# EAGLE design ps3-usb-hid-v10 (EAGLE 5.04)
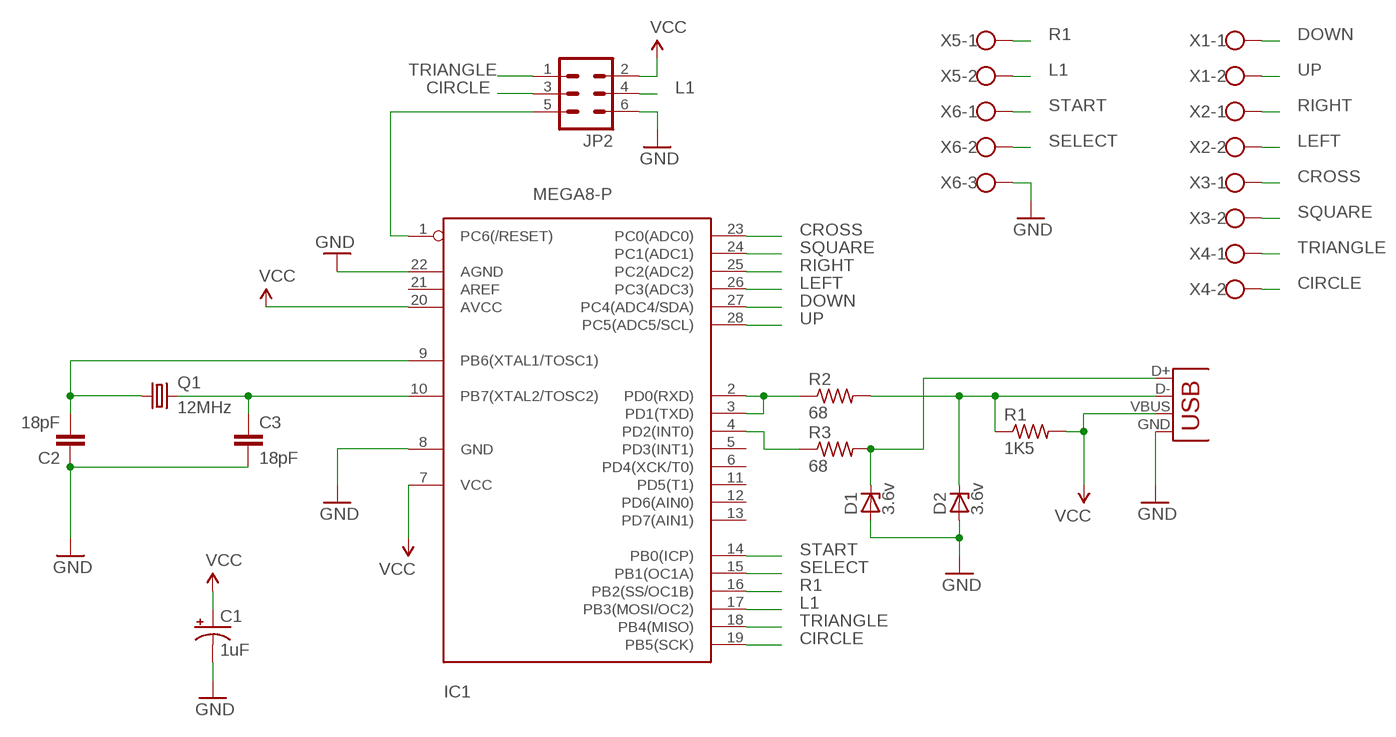
[diagram p0: schematic, sheet 1]

## Parts
C1  1uF  CAP_POLPTH2  [CPOL-RADIAL-10UF-25V]
C2  18pF  CAPPTH  [CAP-PTH-SMALL]
C3  18pF  CAPPTH  [CAP-PTH-SMALL]
D1  3.6v  ZENER-DIODEDO35Z10  [DO35Z10]
D2  3.6v  ZENER-DIODEDO35Z10  [DO35Z10]
IC1  MEGA8-P  [DIL28-3]
JP1  USBPTH  [USB-B-PTH]
JP2  MA03-2  [MA03-2]
Q1  12MHz  CRYSTALHC49S  [HC49/S]
R1  1K5  R-US_0207/10  [0207/10]
R2  68  R-US_0207/10  [0207/10]
R3  68  R-US_0207/10  [0207/10]
X1  W237-102  [W237-102]
X2  W237-102  [W237-102]
X3  W237-102  [W237-102]
X4  W237-102  [W237-102]
X5  W237-102  [W237-102]
X6  W237-103  [W237-103]

## Nets
CIRCLE: IC1.19(PB5(SCK)) JP2.3 X4.2
CROSS: IC1.23(PC0(ADC0)) X3.1
DOWN: IC1.27(PC4(ADC4/SDA)) X1.1
GND: C1.2(-) C2.1 C3.2 D1.A D2.A IC1.8(GND) IC1.22(AGND) JP1.GND JP2.6 X6.3
L1: IC1.17(PB3(MOSI/OC2)) JP2.4 X5.2
LEFT: IC1.26(PC3(ADC3)) X2.2
N$1: C2.2 IC1.9(PB6(XTAL1/TOSC1)) Q1.1
N$2: C3.1 IC1.10(PB7(XTAL2/TOSC2)) Q1.2
N$3: IC1.2(PD0(RXD)) IC1.3(PD1(TXD)) R2.1
N$4: IC1.1(PC6(/RESET)) JP2.5
N$5: D2.C JP1.D- R1.1 R2.2
N$6: IC1.4(PD2(INT0)) R3.1
N$7: D1.C JP1.D+ R3.2
R1: IC1.16(PB2(SS/OC1B)) X5.1
RIGHT: IC1.25(PC2(ADC2)) X2.1
SELECT: IC1.15(PB1(OC1A)) X6.2
SQUARE: IC1.24(PC1(ADC1)) X3.2
START: IC1.14(PB0(ICP)) X6.1
TRIANGLE: IC1.18(PB4(MISO)) JP2.1 X4.1
UP: IC1.28(PC5(ADC5/SCL)) X1.2
VCC: C1.1(+) IC1.7(VCC) IC1.20(AVCC) JP1.VBUS JP2.2 R1.2
Unconnected: IC1.5(PD3(INT1)) IC1.6(PD4(XCK/T0)) IC1.11(PD5(T1)) IC1.12(PD6(AIN0)) IC1.13(PD7(AIN1)) IC1.21(AREF)

## Library data of the parts
C1 = SparkFun:CAP_POL: Capacitor Polarized These are standard SMD and PTH capacitors. Normally 10uF, 47uF, and 100uF in electrolytic and tantalum varieties. Always verify the external diameter of the through hole cap, it varies with capacity, voltage, and manufacturer. The EIA devices should be standard.
C2 C3 = SparkFun:CAP: Capacitor Standard 0603 ceramic capacitor, and 0.1" leaded capacitor.
D1 D2 = diode:ZENER-DIODE: Z-Diode
IC1 = atmel:MEGA8-P: MICROCONTROLLER 8 Kbytes FLASH, 1 kbytes SRAM, 512 bytes EEPROM, USART, 4-channel 10 bit ADC, 2-channel 8 bit ADC Pin compatible with Atmega48, ATMega88, ATMega168 Source: avr.lbr
JP1 = SparkFun:USB: USB Connectors USB-B-PTH is fully proven SKU : PRT-00139 USB-miniB is fully proven SKU : PRT-00587 USB-A-PCB is untested. USB-A-H is throughly reviewed, but untested. Spark Fun Electronics SKU : PRT-00437 USB-B-SMT is throughly reviewed, but untested. Needs silkscreen touching up. USB-A-S has not been used/tested USB-MB-H has not been used/tested
JP2 = con-lstb:MA03-2: PIN HEADER
Q1 = crystal:CRYSTAL: CRYSTAL
R1-R3 = resistor:R-US_: RESISTOR, American symbol
X1-X5 = con-wago-500:W237-102: WAGO SCREW CLAMP
X6 = con-wago-500:W237-103: WAGO SCREW CLAMP

## Board
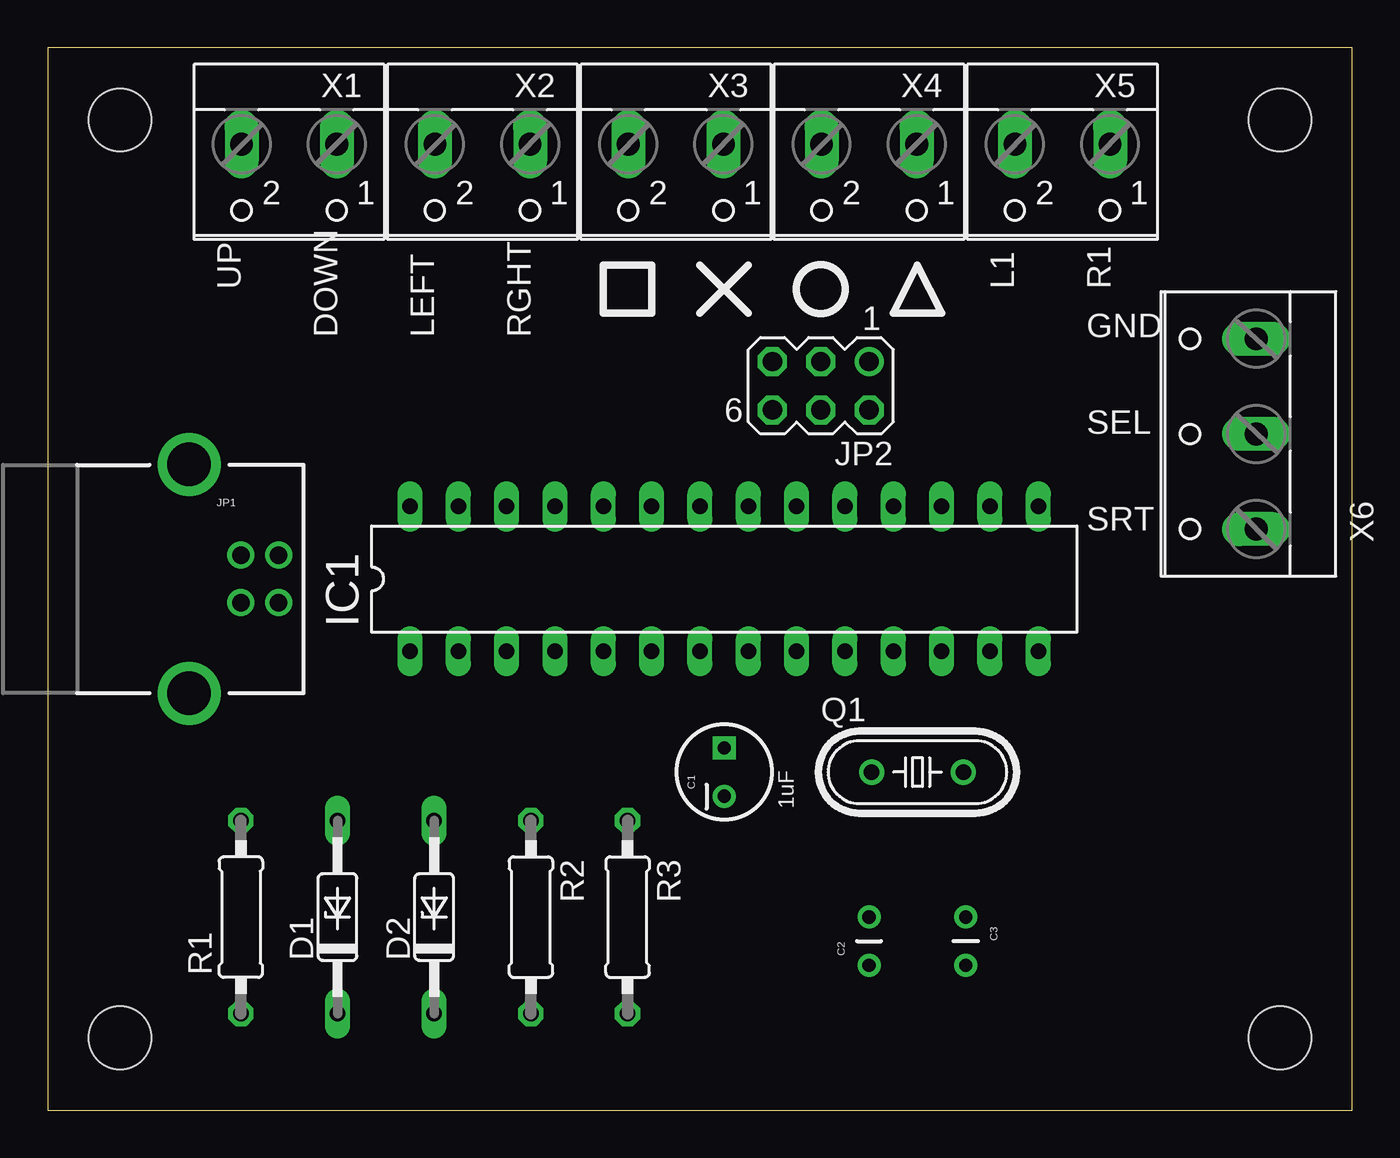
[diagram p1: board, top side]
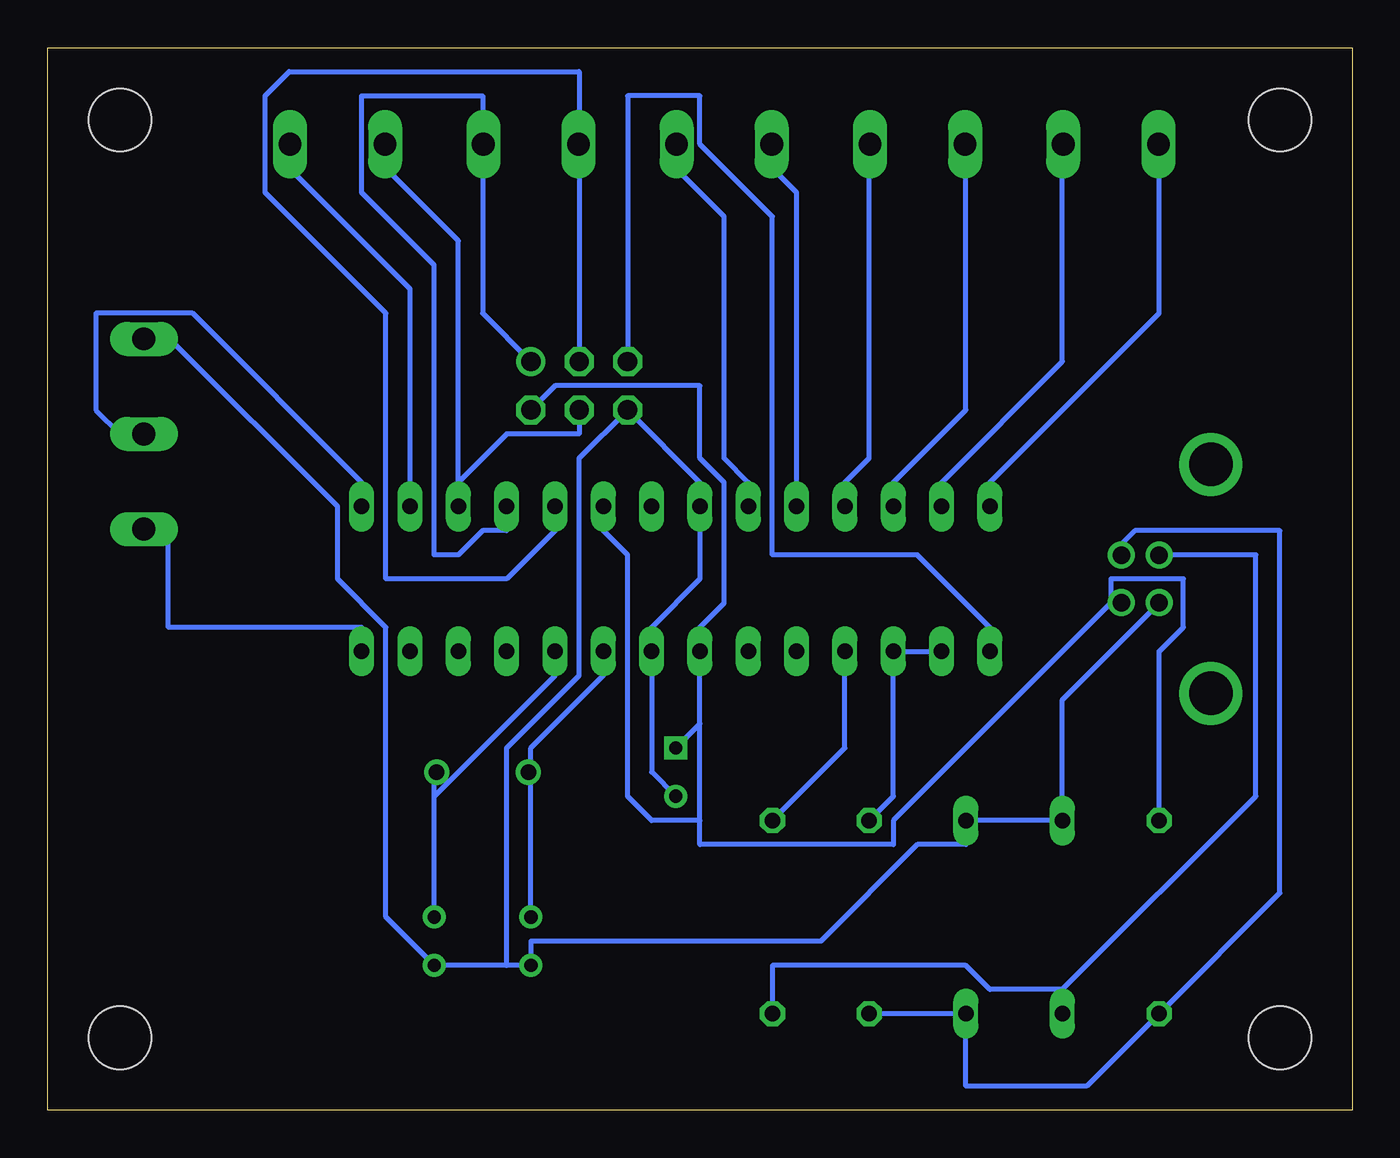
[diagram p2: board, bottom side, seen from below]

Size 68.58 x 55.88 mm. Coordinates in mm from the lower left corner, seen from the top.
Outline: 0,0 68.58,0 68.58,55.88 0,55.88 0,0
Copper layers (1*16): Top 0.035mm / dielectric 1.5mm / Bottom 0.035mm
Design rules "default": minimum track width 10mil, minimum drill 24mil, track to track 8mil, track to pad 8mil, pad to pad 8mil, via to via 8mil, smd to smd 8mil, copper to edge 40mil, drill to drill 8mil, minimum pad ring 10mil, minimum via ring 8mil, stop-mask expansion 4mil, vias tented up to drill 0mil, thermal gap 10mil

### Footprints (pad centres in the part's own frame; a part is rotated, then mirrored left to right if it is on the bottom)
CPOL-RADIAL-10UF-25V = drill 0.7 square: 1 1.27,0 | drill 0.7 round: 2 -1.27,0
CAP-PTH-SMALL = drill 0.7 round: 1 0,0; 2 2.54,0
DO35Z10 = drill 0.813 long: A 5.08,0; C -5.08,0
DIL28-3 = drill 0.813 long: 1 -16.51,-3.81; 2 -13.97,-3.81; 3 -11.43,-3.81; 4 -8.89,-3.81; 5 -6.35,-3.81; 6 -3.81,-3.81; 7 -1.27,-3.81; 8 1.27,-3.81; 9 3.81,-3.81; 10 6.35,-3.81; 11 8.89,-3.81; 12 11.43,-3.81; 13 13.97,-3.81; 14 16.51,-3.81; 15 16.51,3.81; 16 13.97,3.81; 17 11.43,3.81; 18 8.89,3.81; 19 6.35,3.81; 20 3.81,3.81; 21 1.27,3.81; 22 -1.27,3.81; 23 -3.81,3.81; 24 -6.35,3.81; 25 -8.89,3.81; 26 -11.43,3.81; 27 -13.97,3.81; 28 -16.51,3.81
USB-B-PTH = drill 0.914 round: D+ 0,1.25; D- 1.981,1.25; GND 0,-1.25; VBUS 1.981,-1.25 | drill 2.286 round: P$1 -2.718,-6.02; P$2 -2.718,6.02
MA03-2 = drill 1.016 round: 1 -2.54,-1.27 | drill 1.016 octagon: 2 -2.54,1.27; 3 0,-1.27; 4 0,1.27; 5 2.54,-1.27; 6 2.54,1.27
HC49/S = drill 0.813 round: 1 -2.413,0; 2 2.413,0
0207/10 = drill 0.813 octagon: 1 -5.08,0; 2 5.08,0
STAND-OFF = hole 3.302: 0,0
W237-102 = drill 1.194 long: 1 -2.5,-1.27; 2 2.5,-1.27
W237-103 = drill 1.194 long: 1 -5,-1.29; 2 0,-1.29; 3 5,-1.29

### Placement (x,y rotation side)
C1  35.56,17.78 90 top
C2  43.18,7.62 90 top
C3  48.26,10.16 270 top
D1  15.24,10.16 90 top
D2  20.32,10.16 90 top
IC1  35.56,27.94 0 top
JP1  10.16,27.94 0 top
JP2  40.64,38.1 180 top
Q1  45.72,17.78 0 top
R1  10.16,10.16 90 top
R2  25.4,10.16 270 top
R3  30.48,10.16 270 top
U$1  [STAND-OFF]  3.81,52.07 0 top
U$2  [STAND-OFF]  3.81,3.81 0 top
U$3  [STAND-OFF]  64.77,3.81 0 top
U$4  [STAND-OFF]  64.77,52.07 0 top
X1  12.7,49.53 180 top
X2  22.86,49.53 180 top
X3  33.02,49.53 180 top
X4  43.18,49.53 180 top
X5  53.34,49.53 180 top
X6  62.23,35.56 90 top

### Tracks (layer width: path | path; a pad name or v marks a point on that pad's centre or on a via)
CIRCLE
  Bottom 0.254: IC1.19 41.91,30.48 44.45,27.94 50.8,27.94 50.8,41.91 57.15,48.26 57.15,53.34 55.88,54.61 40.64,54.61 40.64,52.07 X4.2 40.64,49.53 JP2.3
CROSS
  Bottom 0.254: IC1.23 31.75,33.02 33.02,34.29 33.02,46.99 35.56,49.53 X3.1
DOWN
  Bottom 0.254: IC1.27 21.59,33.02 15.24,39.37 15.24,49.53 X1.1
GND
  Bottom 0.254: C1.2 36.83,17.78 IC1.8 36.83,25.4 34.29,27.94 IC1.22 34.29,33.02 JP2.6 40.64,34.29 40.64,22.86 44.45,19.05 44.45,7.62 | JP1.GND 10.16,26.67 15.24,21.59 D1.A D2.A 20.32,13.97 22.86,13.97 27.94,8.89 43.18,8.89 C2.1 44.45,7.62 | 44.45,7.62 C3.2 50.8,10.16 50.8,25.4 53.34,27.94 53.34,31.75 62.23,40.64 X6.3
L1
  Bottom 0.254: 46.99,33.02 44.45,35.56 40.64,35.56 JP2.4 | 46.99,33.02 46.99,45.72 50.8,49.53 X5.2 | 46.99,33.02 IC1.17
LEFT
  Bottom 0.254: IC1.26 24.13,33.02 20.32,36.83 20.32,49.53 X2.2
N$1
  Bottom 0.254: C2.2 43.18,17.78 | 43.18,17.78 43.18,19.05 39.37,22.86 IC1.9 | 43.18,17.78 Q1.1
N$2
  Bottom 0.254: 48.26,16.51 48.26,17.78 Q1.2 | C3.1 48.26,16.51 | 48.26,16.51 41.91,22.86 IC1.10
N$3
  Bottom 0.254: R2.1 24.13,16.51 IC1.3 IC1.2
N$4
  Bottom 0.254: JP2.5 38.1,53.34 34.29,53.34 34.29,50.8 30.48,46.99 30.48,29.21 22.86,29.21 19.05,25.4 IC1.1
N$5
  Bottom 0.254: R2.2 D2.C 20.32,1.27 13.97,1.27 R1.1 3.81,11.43 3.81,30.48 11.43,30.48 12.7,29.21 JP1.D-
N$6
  Bottom 0.254: R3.1 26.67,19.05 IC1.4
N$7
  Bottom 0.254: 15.24,6.35 19.05,6.35 20.32,7.62 30.48,7.62 R3.2 | 15.24,6.35 5.08,16.51 5.08,29.21 10.16,29.21 JP1.D+ | D1.C 15.24,6.35
R1
  Bottom 0.254: IC1.16 49.53,43.18 55.88,49.53 X5.1
RIGHT
  Bottom 0.254: IC1.25 26.67,33.02 25.4,34.29 25.4,49.53 X2.1
SELECT
  Bottom 0.254: IC1.15 52.07,33.02 60.96,41.91 66.04,41.91 66.04,36.83 64.77,35.56 X6.2
SQUARE
  Bottom 0.254: IC1.24 29.21,48.26 30.48,49.53 X3.2
START
  Bottom 0.254: IC1.14 52.07,25.4 62.23,25.4 62.23,30.48 X6.1
TRIANGLE
  Bottom 0.254: IC1.18 44.45,30.48 45.72,30.48 46.99,29.21 48.26,29.21 48.26,44.45 52.07,48.26 52.07,53.34 45.72,53.34 45.72,52.07 X4.1 45.72,49.53 45.72,41.91 JP2.1
UP
  Bottom 0.254: IC1.28 19.05,33.02 10.16,41.91 10.16,49.53 X1.2
VCC
  Bottom 0.254: R1.2 10.16,24.13 8.89,25.4 8.89,27.94 12.7,27.94 12.7,26.67 | 34.29,20.32 C1.1 | 34.29,20.32 IC1.7 34.29,25.4 33.02,26.67 33.02,33.02 34.29,34.29 34.29,38.1 41.91,38.1 JP2.2 | 34.29,15.24 36.83,15.24 38.1,16.51 38.1,29.21 39.37,30.48 IC1.20 | 34.29,15.24 34.29,20.32 | 12.7,26.67 24.13,15.24 24.13,13.97 34.29,13.97 34.29,15.24 | 12.7,26.67 JP1.VBUS

### Text on the board
tPlace: UP | L1 | R1 | DOWN | LEFT | RGHT | GND | SEL | SRT